# Altium project Serializer_Board.PrjPcb (part 1 of 2)
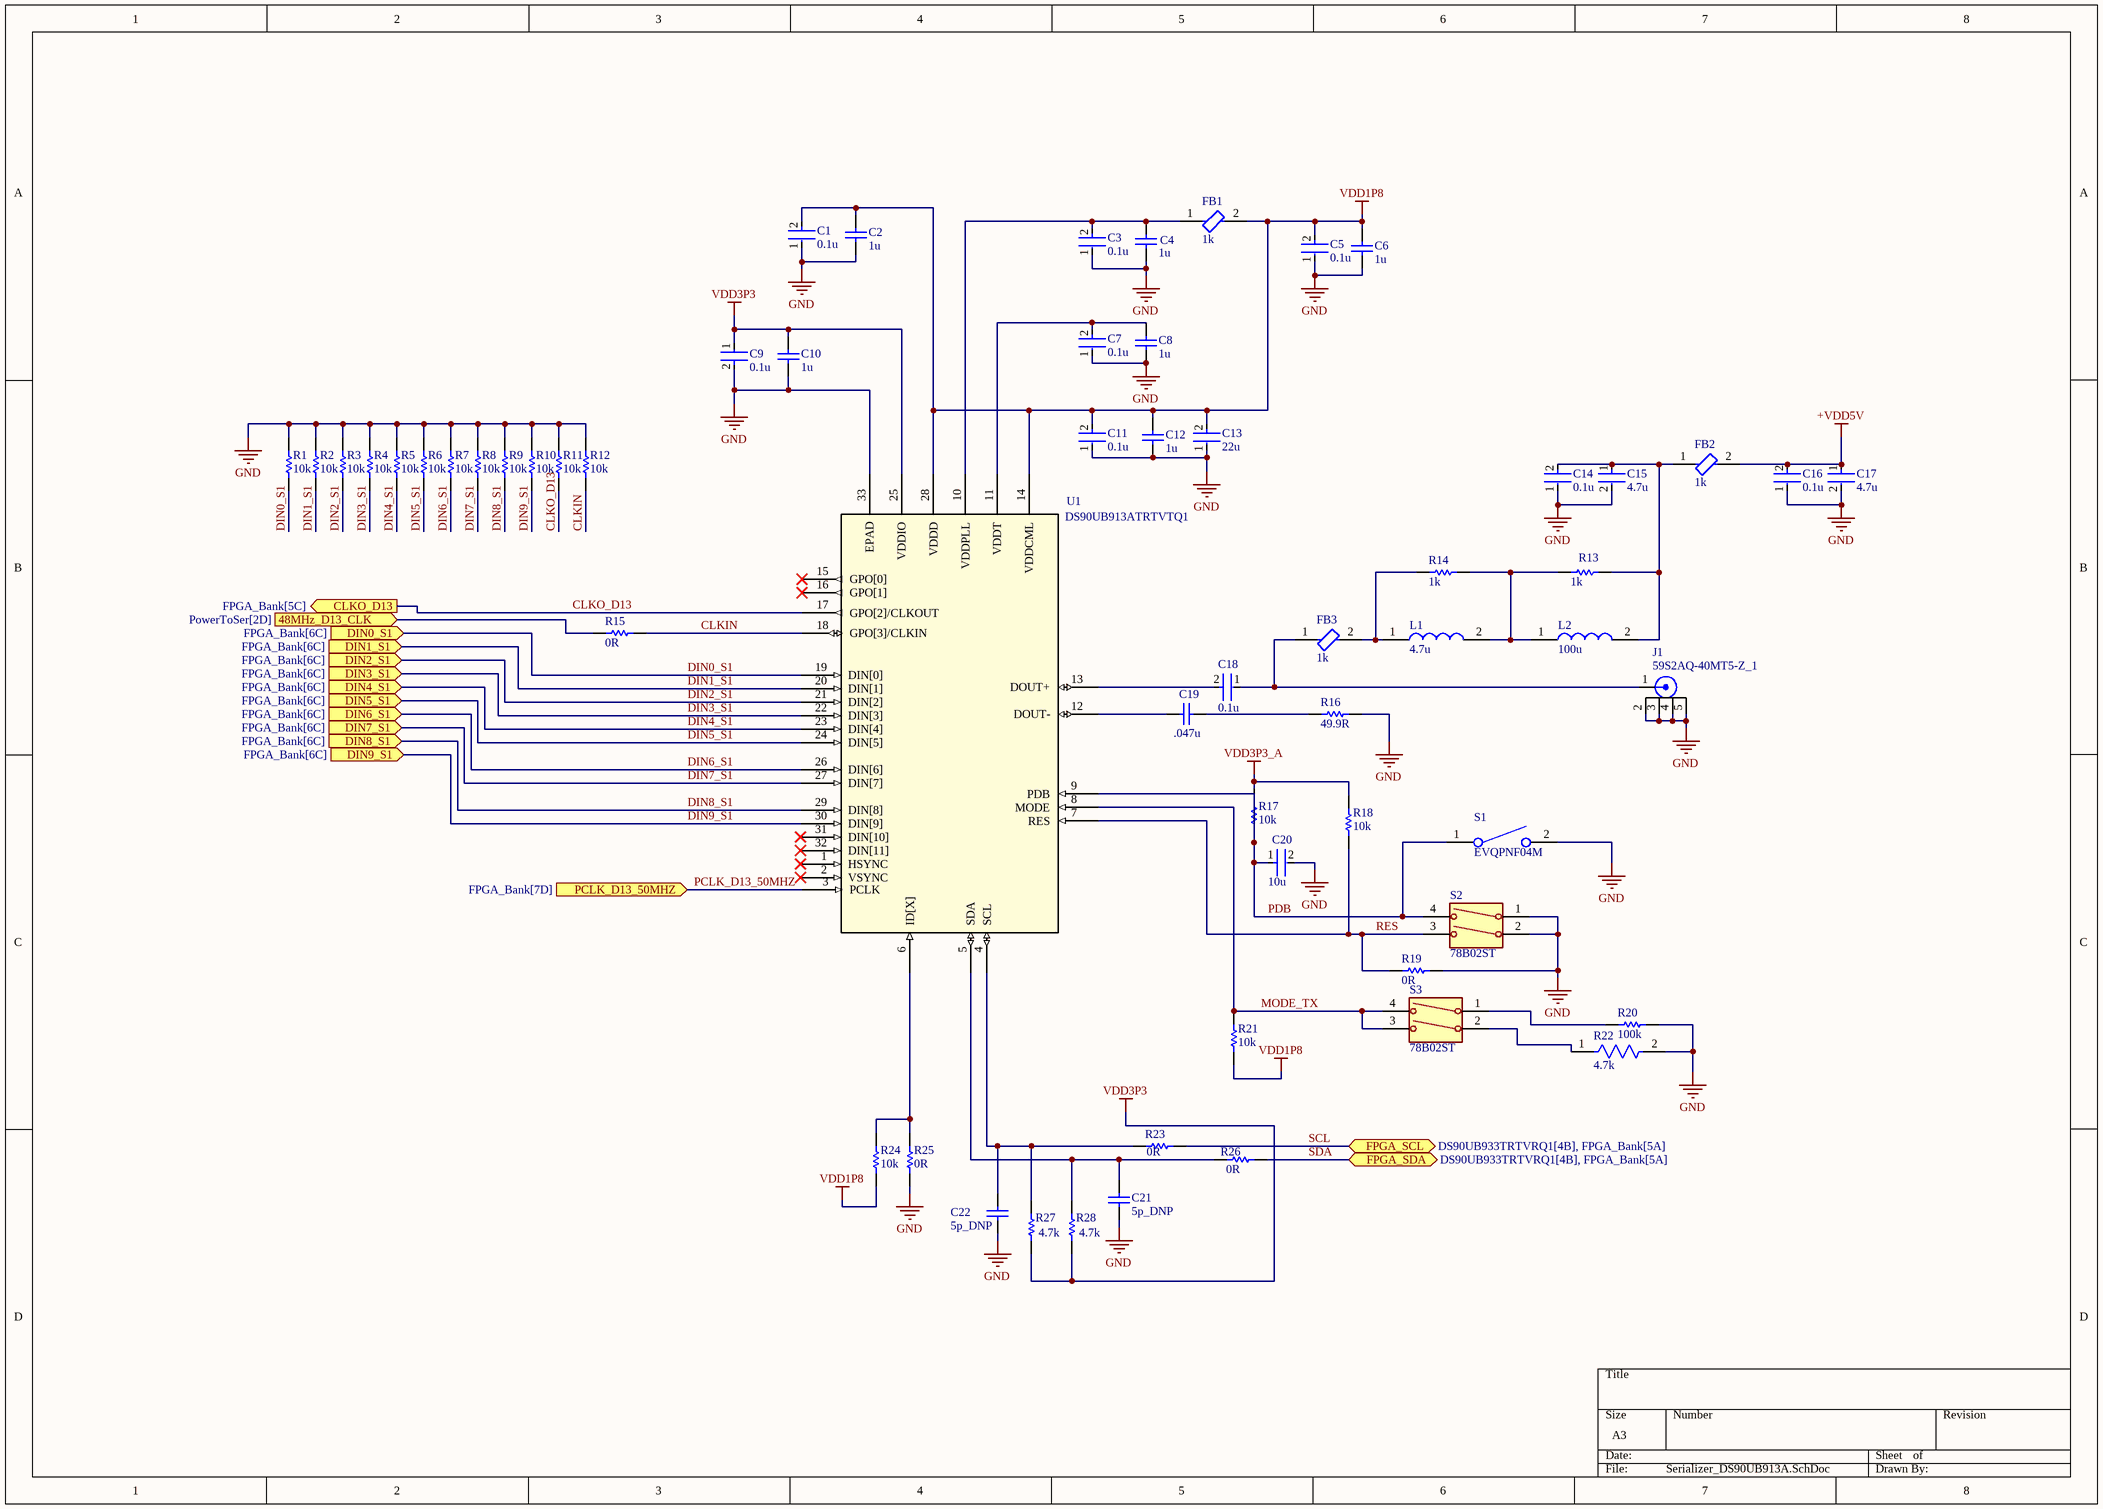
[diagram p0: Serializer_DS90UB913A.SchDoc]
5 sheets, 220 parts. Net scope: flat (ports and power ports of the same name join across sheets).
Sheets:
  Serializer_DS90UB913A.SchDoc
  BuckRegulatorOnSer.SchDoc
  PowerToSer.SchDoc
  FTDI_USB_To_UART.SchDoc
  FPGA_Bank.SchDoc

## Sheet Serializer_DS90UB913A.SchDoc
size A3; SheetNumber: 1; SheetTotal: 6

### Parts
C1  0.1u  [FP-GRM15-MFG]
C2  1u  [CAPC1608X90X35ML10T15]
C3  0.1u  [FP-GRM15-MFG]
C4  1u  [CAPC1608X90X35ML10T15]
C5  0.1u  [FP-GRM15-MFG]
C6  1u  [CAPC1608X90X35ML10T15]
C7  0.1u  [FP-GRM15-MFG]
C8  1u  [CAPC1608X90X35ML10T15]
C9  0.1u  [FP-GRM15-MFG]
C10  1u  [CAPC1608X90X35ML10T15]
C11  0.1u  [FP-GRM15-MFG]
C12  1u  [CAPC1608X90X35ML10T15]
C13  22u  [FP-GCM32E-0_3-IPC_B]
C14  0.1u  [FP-GRM15-MFG]
C15  4.7u  [FP-GRM21B-0_15-MFG]
C16  0.1u  [FP-GRM15-MFG]
C17  4.7u  [FP-GRM21B-0_15-MFG]
C18  0.1u  [FP-GRM15-MFG]
C19  .047u  [CAPC1608X90X35ML10T15]
C20  10u  [FP-GRM21B-0_1-IPC_C]
C21  5p_DNP  [CAPC1005X55X25LL05T10]
C22  5p_DNP  [CAPC1005X55X25LL05T10]
FB1  1k  [FP-BLM18-0_15-t0_8-MFG]
FB2  1k  [FP-BLM18-0_15-t0_8-MFG]
FB3  1k  [FP-BLM18-0_15-t0_8-MFG]
J1  59S2AQ-40MT5-Z_1  [ROSENBERGER_59S2AQ-40MT5-Z_1]
L1  4.7u  [1008PS]
L2  100u  [MSS7341T104MLB]
R1  10k  [RESC1005X40X25ML05T05]
R2  10k  [RESC1005X40X25ML05T05]
R3  10k  [RESC1005X40X25ML05T05]
R4  10k  [RESC1005X40X25ML05T05]
R5  10k  [RESC1005X40X25ML05T05]
R6  10k  [RESC1005X40X25ML05T05]
R7  10k  [RESC1005X40X25ML05T05]
R8  10k  [RESC1005X40X25ML05T05]
R9  10k  [RESC1005X40X25ML05T05]
R10  10k  [RESC1005X40X25ML05T05]
R11  10k  [RESC1005X40X25ML05T05]
R12  10k  [RESC1005X40X25ML05T05]
R13  1k  [RESC1608X55X30LL15T15]
R14  1k  [RESC1608X55X30LL15T15]
R15  0R  [RESC1005X40X25LL05T05]
R16  49.9R  [RESC1608X55X30ML15T15]
R17  10k  [RESC1005X40X25ML05T05]
R18  10k  [RESC1005X40X25ML05T05]
R19  0R  [RESC1005X40X25LL05T05]
R20  100k  [RESC2013X70X40ML20T20]
R21  10k  [RESC1005X40X25ML05T05]
R22  4.7k  [FP-ERJ6GE-MFG]
R23  0R  [RESC1005X40X25LL05T05]
R24  10k  [RESC1005X40X25ML05T05]
R25  0R  [RESC1005X40X25LL05T05]
R26  0R  [RESC1005X40X25LL05T05]
R27  4.7k  [RESC1005X40X25LL05T05]
R28  4.7k  [RESC1005X40X25LL05T05]
S1  EVQPNF04M  [EVQ5PN05K]
S2  78B02ST  [78B02ST]
S3  78B02ST  [78B02ST]
U1  DS90UB913ATRTVTQ1  [RTV32_3P1X3P1_TEX]

### Ports
48MHz_D13_CLK (in, see PowerToSer[2D]), CLKO_D13 (out, see FPGA_Bank[5C]), DIN0_S1 (in, see FPGA_Bank[6C]), DIN1_S1 (in, see FPGA_Bank[6C]), DIN2_S1 (in, see FPGA_Bank[6C]), DIN3_S1 (in, see FPGA_Bank[6C]), DIN4_S1 (in, see FPGA_Bank[6C]), DIN5_S1 (in, see FPGA_Bank[6C]), DIN6_S1 (in, see FPGA_Bank[6C]), DIN7_S1 (in, see FPGA_Bank[6C]), DIN8_S1 (in, see FPGA_Bank[6C]), DIN9_S1 (in, see FPGA_Bank[6C]), FPGA_SCL (bidir, see DS90UB933TRTVRQ1[4B], FPGA_Bank[5A]), FPGA_SDA (bidir, see DS90UB933TRTVRQ1[4B], FPGA_Bank[5A]), PCLK_D13_50MHZ (in, see FPGA_Bank[7D])

### Nets
+VDD5V: C16.2 C17.1 FB2.2
GND: C1.1 C2.1 C3.1 C4.1 C5.1 C6.1 C7.1 C8.1 C9.2 C10.1 C11.1 C12.1 C13.1 C14.1 C15.2 C16.1 C17.2 C20.2 C21.1 C22.1 J1.2 J1.3 J1.4 J1.5 R1.2 R2.2 R3.2 R4.2 R5.2 R6.2 R7.2 R8.2 R9.2 R10.2 R11.2 R12.2 R16.2 R19.1 R20.2 R22.2 R25.1 S1.2(NO) S2.1(COM_1) S2.2(NO_1) U1.33(EPAD)
VDD1P8: C1.2 C2.2 C5.2 C6.2 C11.2 C12.2 C13.2 FB1.2 R21.1 R24.1 U1.14(VDDCML) U1.28(VDDD)
VDD3P3: C9.1 C10.2 R27.1 R28.1 U1.25(VDDIO)
VDD3P3_A: R17.2 R18.2
CLKIN: R12.1 R15.1 U1.18(GPO[3]/CLKIN)  [project net CLKIN_1]
CLKO_D13: R11.1 U1.17(GPO[2]/CLKOUT) ; port CLKO_D13
DIN0_S1: R1.1 U1.19(DIN[0]) ; port DIN0_S1
DIN1_S1: R2.1 U1.20(DIN[1]) ; port DIN1_S1
DIN2_S1: R3.1 U1.21(DIN[2]) ; port DIN2_S1
DIN3_S1: R4.1 U1.22(DIN[3]) ; port DIN3_S1
DIN4_S1: R5.1 U1.23(DIN[4]) ; port DIN4_S1
DIN5_S1: R6.1 U1.24(DIN[5]) ; port DIN5_S1
DIN6_S1: R7.1 U1.26(DIN[6]) ; port DIN6_S1
DIN7_S1: R8.1 U1.27(DIN[7]) ; port DIN7_S1
DIN8_S1: R9.1 U1.29(DIN[8]) ; port DIN8_S1
DIN9_S1: R10.1 U1.30(DIN[9]) ; port DIN9_S1
MODE_TX: R21.2 S3.3(COM_2) S3.4(NO_2) U1.8(MODE)  [project net MODE_TX_1]
PCLK_D13_50MHZ: U1.3(PCLK) ; port PCLK_D13_50MHZ
PDB: C20.1 R17.1 S1.1(COM) S2.4(NO_2) U1.9(PDB)  [project net PDB_1]
RES: R18.1 R19.2 S2.3(COM_2) U1.7(RES)  [project net RES_1]
SCL: R23.1 ; port FPGA_SCL
SDA: R26.1 ; port FPGA_SDA
NetC3_2: C3.2 C4.2 FB1.1 U1.10(VDDPLL)
NetC7_2: C7.2 C8.2 U1.11(VDDT)
NetC14_2: C14.2 C15.1 FB2.1 L2.2 R13.2
NetC18_1: C18.1 FB3.1 J1.1
NetC18_2: C18.2 U1.13(DOUT+)
NetC19_1: C19.1 U1.12(DOUT-)
NetC19_2: C19.2 R16.1
NetC21_2: C21.2 R26.2 R28.2 U1.5(SDA)
NetC22_2: C22.2 R23.2 R27.2 U1.4(SCL)
NetFB3_2: FB3.2 L1.1 R14.1
NetL1_2: L1.2 L2.1 R13.1 R14.2
NetR15_2: R15.2 ; port 48MHz_D13_CLK
NetR20_1: R20.1 S3.1(COM_1)
NetR22_1: R22.1 S3.2(NO_1)
NetR24_2: R24.2 R25.2 U1.6(ID[X])

Not connected (* = marked no-connect by the designer): U1 1(HSYNC)* 2(VSYNC)* 15(GPO[0])* 16(GPO[1])* 31(DIN[10])* 32(DIN[11])*

### Library data of the parts
C1 C3 C5 C7 C9 C11 C14 C16 C18 = CMP-2100-03641-2: CAP CER 0.1UF 16V X7R 0402; Manufacturer Part Number: GRM155R71C104KA88D; Manufacturer: Murata; Standoff Height: 0mm; Tolerance: 10%; Voltage Rating: 16Vdc; Material: Ceramic; Capacitance: 0.10μF; Value: 0.10μF; RoHS: TRUE; Temperature Characteristic: X7R; Octopart: https://octopart.com/grm155r71c104ka88d-murata-196880; Digikey Description: CAP CER 0.1UF 16V X7R 0402; Device Class L3: Ceramic Capacitors; Height: 0.55mm; ComponentLink2Description: Datasheet; Temperature Range Low: -55°C; Ipc Land Pattern Name: CAPC10050X219; ComponentLink2URL: https://search.murata.co.jp/Ceramy/image/img/A01X/G101/ENG/GRM155R71H471KA01-01A.pdf; Device Class L1: Passive Components; Lead Free: yes; Category: Cap; Package: GRM15; Temperature: -55°C to +125°C; Device Class L2: Capacitors; Temperature Range High: +125°C; Mouser Description: 0402 0.1 uF 16V ±10 % Tolerance X7R SMT Multilayer Ceramic Capacitor
C2 C4 C6 C8 C10 C12 = CMP-2006-02460-1: Manufacturer: Murata; Part Number: GRM188R71E105KA12D
C13 = CMP-06035-049658-1: Ceramic Capacitor for Automotive 22uF ±10% 16VDC X7R 1210 Embossed T/R; Voltage Rating: 16V; Max Operating Temperature: 125°C; Case/Package: 1210; Packaging: Tape and Reel; Termination: SMD/SMT; Height: 2.5mm; Voltage Rating (DC): 16V; Length: 3.2mm; Width: 0.098inch; Voltage: 16V; Depth: 2.5mm; Package Quantity: 1; Mount: Surface Mount; Min Operating Temperature: -55°C; Case Code (Metric): 3225; Case Code (Imperial): 1210; Radiation Hardening: No; Thickness: 0.106inch; Ratings: AEC-Q200; Capacitance: 22uF; Tolerance: 10%; Dielectric: X7R; Lead Free: Lead Free
C15 C17 = CMP-2007-03401-2: CAP CER 4.7UF 16V X7R 0805; Material: Ceramic; Tolerance: 10%; Case Code (Metric): 2012; Voltage Rating: 16V; RoHS Compliant: Yes; Voltage Rating (DC): 16V; Case/Package: 0805; Number of Pins: 2; Thickness: 0.053inch; Voltage: 16V; Mount: Surface Mount; Packaging: Tape and Reel; Lead Free: Lead Free; Case Code (Imperial): 0805; Series: GRM; Width: 0.049inch; Package Quantity: 1; Construction: Flat; Min Operating Temperature: -55°C; Termination: SMD/SMT; Max Operating Temperature: 125°C; Length: 2mm; Dielectric: X7R; Depth: 1.25mm; REACH SVHC: No SVHC; Height: 1.25mm; Capacitance: 4.7uF
C19 = CMP-2006-02927-1: Manufacturer: Murata; Part Number: GRM188R71H473KA61D
C20 = CMP-2007-03453-2: Chip Multilayer Ceramic Capacitors for General Purpose, 0805, 10uF, X5R, 15%, 10%, 16V; Radiation Hardening: No; Thickness: 0.053inch; Voltage Rating (DC): 16V; Lead Free: Lead Free; Package Quantity: 1; Width: 1.25mm; Case Code (Imperial): 0805; Depth: 1.25mm; Packaging: Tape and Reel; Dielectric: X5R; Max Operating Temperature: 85°C; Tolerance: 10%; Voltage Rating: 16V; Voltage: 16V; Capacitance: 10uF; Height: 1.25mm; Case Code (Metric): 2012; Material: Ceramic; Mount: Surface Mount; Case/Package: 0805; REACH SVHC: No SVHC; Length: 2mm; Min Operating Temperature: -55°C; Termination: SMD/SMT
C21 C22 = CMP-2008-04391-1: Manufacturer: Murata; Part Number: GRM1555C1H5R0CA01D
FB1-FB3 = CMP-0686-00457-3: Chip Ferrite Bead, 0603, 1000Ω @ 100MHz, 0.5Ω, 25%, 450mABLM18AG102SN1D; Number of Circuits: 1; Max DC Current: 400mA; Shielding: Unshielded; DC Resistance (DCR): 500mR; Material: Steel; DC Resistance-Max: 700mR; Impedance: 1kR; Case Code (Imperial): 0603; Max Current Rating: 400mA; Frequency: 100MHz; Min Operating Temperature: -55°C; Case/Package: 0603; Depth: 0.8mm; Lead Free: Lead Free; Core Material: Ferrite; Current Rating: 400mA; Resistance: 500mR; Case Code (Metric): 1608; DC Current: 400mA; Package Quantity: 1; Packaging: Tape and Reel; Width: 0.8mm; Military Standard: Not; Height: 0.8mm; Series: BLM18A; Max Operating Temperature: 125°C; Tolerance: 25%; Termination: SMD/SMT; Test Frequency: 100MHz; Number of Lines: 1; Number of Pins: 2; REACH SVHC: No SVHC; Length: 1.6mm; Radiation Hardening: No
J1 = 59S2AQ-40MT5-Z_1: RF Connectors / Coaxial Connectors Plug PC-Board SMD Right AngleZWatrBlue; Package: None; Price: None; Value: *; MP: 59S2AQ-40MT5-Z_1; Availability: Unavailable
L1 = 1008PS-472KLB: Inductor; Manufacturer_Name: COILCRAFT; Datasheet Link: https://www.coilcraft.com/pdfs/1008ps.pdf; Manufacturer_Part_Number: 1008PS-472KLB; Mouser Part Number: 994-1008PS-472KLB; Mouser Price/Stock: https://www.mouser.co.uk/ProductDetail/Coilcraft/1008PS-472KLB?qs=zCSbvcPd3pZjtFGTYwqcAw%3D%3D
L2 = MSS7341T-104MLB: Inductor; Manufacturer_Name: COILCRAFT; Manufacturer_Part_Number: MSS7341T-104MLD; Datasheet Link: https://componentsearchengine.com/Datasheets/2/MSS7341T-104MLD.pdf; Height: 4.1mm; Mouser Part Number: 994-MSS7341T-104MLD; Mouser Price/Stock: https://www.mouser.co.uk/ProductDetail/Coilcraft/MSS7341T-104MLD?qs=zCSbvcPd3paCy6uSM7W%2FOg%3D%3D
R1-R12 R17 R18 R21 R24 = CMP-2002-00433-1: Part Number: ERJ-2GEJ103X; Manufacturer: Panasonic
R13 R14 = CMP-2000-00180-1: Part Number: ERJ-3EKF1001V; Manufacturer: Panasonic
R15 R19 R23 R25 R26 = CMP-2000-07451-1: Chip Resistor, 0 Ohm, 0.1 W, -55 to 155 degC, 0402 (1005 Metric), RoHS, Tape and Reel; Manufacturer: Panasonic; Voltage Rating (DC): 50V; Temperature Coefficient: 600ppm/��C; Max Power Dissipation: 100mW; Resistance: 0mOhm; Tolerance: 5%; Number of Terminations: 2; Mount: SurfaceMount; Height: 0.35mm; Packaging: TapeandReel; Contact Plating: Tin; Manufacturer URL: http://www.panasonic.com/; Composition: ThickFilm; Max Operating Temperature: 155degC; REACH SVHC: NoSVHC; Case/Package: 0402; Package Reference: 402; Depth: 0.5mm; Package Description: 2-Pin Surface Mount Device, Body 1 x 0.5 mm; Datasheet URL: https://industrial.panasonic.com/cdbs/www-data/pdf/RDA0000/AOA0000C301.pdf; RoHSCompliant: True; Case Code (Imperial): 0402; Military Standard: Not; Min Operating Temperature: -55degC; Power Rating: 100mW; Datasheet Version: 03/2015; Length: 1mm; Case Code (Metric): 1005; Termination: SMD/SMT; Mounting Technology: SurfaceMount; Voltage Rating: 50V; Width: 0.02inch; Package Quantity: 1; Lead Free: LeadFree; Radiation Hardening: No
R16 = CMP-2000-00538-1: Manufacturer: Panasonic; Part Number: ERJ-3EKF49R9V
R20 = CMP-2001-04377-1: Part Number: ERJ-6ENF1003V; Manufacturer: Panasonic
R22 = CMP-2001-00420-2: RES SMD 4.7K OHM 5% 1/8W 0805; Power Rating: 125mW; Voltage Rating (DC): 150V; Temperature Coefficient: 200ppm/°C; Resistance: 4.7kR; Lead Free: Lead Free; Length: 2mm; Resistance Tolerance: 5%; Tolerance: 5%; Mount: Surface Mount; Number of Terminations: 2; Technology: THICK FILM; Case Code (Metric): 2012; Resistor Type: Thick Film; Max Power Dissipation: 125mW; Series: ERJ; Radiation Hardening: No; Min Operating Temperature: -55°C; RoHS Compliant: Yes; Case/Package: 0805; Package Quantity: 5000; Size Code: 0805; Width: 0.049inch; Voltage Rating: 150V; Contact Plating: Tin; Military Standard: Not; Height: 0.6mm; Construction: Rectangular; Packaging: Tape and Reel; Max Operating Temperature: 155°C; Termination: SMD/SMT; REACH SVHC: No SVHC; Case Code (Imperial): 0805; Depth: 1.25mm
R27 R28 = CMP-2002-01154-4: Chip Resistor, 4.7 KOhm, +/- 1%, 0.1 W, -55 to 155 degC, 0402 (1005 Metric), RoHS, Tape and Reel; PartNumber: ERJ-2RKF4701X; Voltage Rating: 50 V; Case\/Package: 0402; Power Rating: 100 mW; Height: 0.35 mm; Mounting Technology: Surface Mount; REACH SVHC: Yes; Resistance: 4.7 KOhm; Max Operating Temperature: 155 degC; ComponentLink1Description: Manufacturer URL; ComponentLink2Description: Datasheet; Pins: 2; PackageReference: 0402; Tolerance: 1%; Case Code (Imperial): 0402; Length: 1 mm; PackageDescription: 2-Pin Surface Mount Device, Body 1 x 0.5 mm; RoHSCompliant: true; Package Quantity: 1; Radiation Hardening: No; DatasheetVersion: 04/2015; Width: 0.5 mm; Case Code (Metric): 1005; Mount: Surface Mount; ComponentLink1URL: http://www.panasonic.com/; Min Operating Temperature: -55 degC; Packaging: Cut Tape; ComponentLink2URL: http://industrial.panasonic.com/cdbs/www-data/pdf/RDA0000/AOA0000C86.pdf
S1 = EVQPNF04M: Switch; Manufacturer_Name: Panasonic; Datasheet Link: https://industrial.panasonic.com/cdbs/www-data/pdf/ATK0000/ATK0000C376.pdf; Manufacturer_Part_Number: EVQPNF04M
S2 S3 = 78B02ST: PCB Slide Switch Single Pole Single Throw (SPST) 150 mA Slide; Manufacturer_Name: Grayhill; Geometry.Height: 7.49mm; Mouser Part Number: 706-78B02ST; Mouser Price/Stock: https://www.mouser.co.uk/ProductDetail/Grayhill/78B02ST?qs=ls7QRyWmRk63wsT9ZvgLUg%3D%3D; Manufacturer_Part_Number: 78B02ST; Datasheet Link: https://datasheet.datasheetarchive.com/originals/distributors/SFDatasheet-7/sf-000148477.pdf
U1 = DS90UB913ATRTVTQ1: 25- to 100-MHz, 10-bit & 12-bit FPD-Link III serializer 32-WQFN -40 to 105; Manufacturer_Name: Texas Instruments; Copyright: Copyright (C) 2025 Ultra Librarian. All rights reserved.; Manufacturer_Part_Number: DS90UB913ATRTVTQ1; RefDes: RefDes; Type: Type

## Sheet BuckRegulatorOnSer.SchDoc
size 381 x 241 mm; SheetNumber: 2; SheetTotal: 6
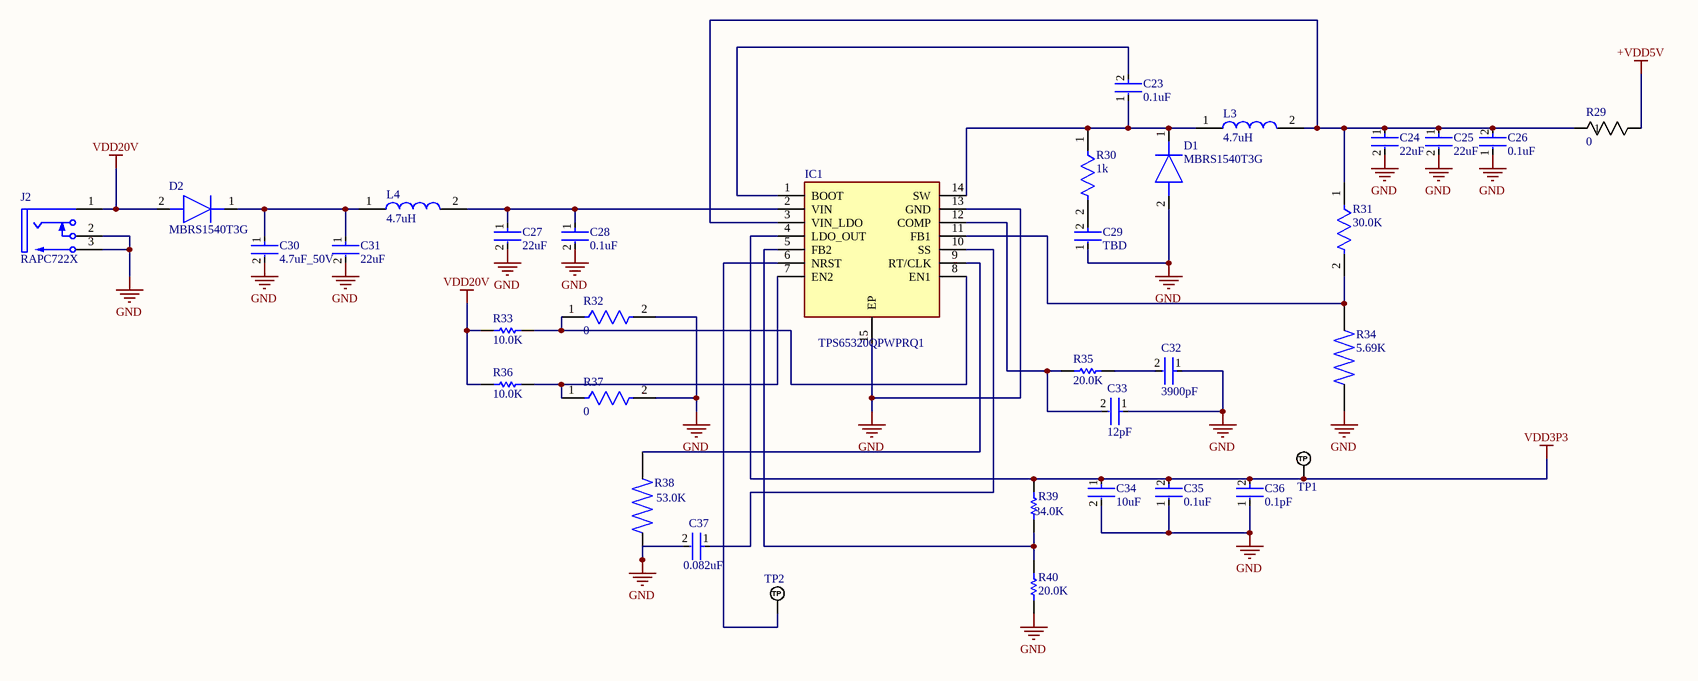
[diagram p1: BuckRegulatorOnSer.SchDoc]

### Parts
C23  0.1uF  [FP-GRM15-MFG]
C24  22uF  [FP-C3216-160-0_2-IPC_B]
C25  22uF  [FP-C3216-160-0_2-IPC_B]
C26  0.1uF  [FP-GRM15-MFG]
C27  22uF  [FP-C3216-160-0_2-IPC_B]
C28  0.1uF  [FP-GRM188-0_1-e0_2_0_5-IPC_B]
C29  TBD  [FP-GRM15-MFG]
C30  4.7uF_50V  [FP-C3216-160-0_2-IPC_B]
C31  22uF  [FP-C3216-160-0_2-IPC_B]
C32  3900pF  [FP-C0402-BB-MFG]
C33  12pF  [FP-C0402-BB-MFG]
C34  10uF  [FP-C2012-125-0_2-MFG]
C35  0.1uF  [FP-GRM15-MFG]
C36  0.1pF  [FP-GRM15-MFG]
C37  0.082uF  [FP-C0402-BB-MFG]
D1  MBRS1540T3G  [DIOM5436X256N]
D2  MBRS1540T3G  [DIOM5436X256N]
IC1  TPS65320QPWPRQ1  [SOP65P640X120-15N]
J2  RAPC722X  [SWITCH-RAPC712X-3_V]
L3  4.7uH  [XFL4020472MEB]
L4  4.7uH  [XFL4020472MEB]
R29  0  [RC2512N_VIS]
R30  1k  [FP-CRCW0603-e3-MFG]
R31  30.0K  [FP-ERJ3EK-IPC_A]
R32  0  [FP-ERJ-3GEY0R00V-MFG]
R33  10.0K  [RESC1609X55X30LL15T15]
R34  5.69K  [RESC1608X46N]
R35  20.0K  [RESC1608X55X30ML15T15]
R36  10.0K  [RESC1609X55X30LL15T15]
R37  0  [FP-ERJ-3GEY0R00V-MFG]
R38  53.0K  [RESC1608X46N]
R39  34.0K  [RESC1608X55X30ML15T15]
R40  20.0K  [RESC1608X55X30ML15T15]
TP1  TP_NOBOM  [PAD_RND_1MM]  (value not drawn)  (no BOM)
TP2  TP_NOBOM  [PAD_RND_1MM]  (value not drawn)  (no BOM)

### Nets
+VDD5V: R29.2
GND: C24.2 C25.2 C26.1 C27.2 C28.2 C29.1 C30.2 C31.2 C32.1 C33.1 C34.2 C35.1 C36.1 C37.2 D1.2(A) IC1.13(GND) IC1.15(EP) J2.2 J2.3 R32.2 R34.2 R37.2 R38.2 R40.2
VDD3P3: C34.1 C35.2 C36.2 IC1.4(LDO_OUT) R39.1 TP1.1(TP)
VDD20V: D2.2(A) J2.1 R33.1 R36.1
NetC23_1: C23.1 D1.1(K) IC1.14(SW) L3.1 R30.1
NetC23_2: C23.2 IC1.1(BOOT)
NetC24_1: C24.1 C25.1 C26.2 IC1.3(VIN_LDO) L3.2 R29.1 R31.1
NetC27_1: C27.1 C28.1 IC1.2(VIN) L4.2
NetC29_2: C29.2 R30.2
NetC30_1: C30.1 C31.1 D2.1(K) L4.1
NetC32_2: C32.2 R35.2
NetC33_2: C33.2 IC1.12(COMP) R35.1
NetC37_1: C37.1 IC1.10(SS)
NetIC1_5: IC1.5(FB2) R39.2 R40.1
NetIC1_6: IC1.6(NRST) TP2.1(TP)
NetIC1_7: IC1.7(EN2) R36.2 R37.1
NetIC1_8: IC1.8(EN1) R32.1 R33.2
NetIC1_9: IC1.9(RT/CLK) R38.1
NetIC1_11: IC1.11(FB1) R31.2 R34.1

### Library data of the parts
C23 C26 C29 C35 C36 = CMP-2100-03641-2: as C1 on sheet Serializer_DS90UB913A; RoHS: TRUE; Temperature Characteristic: X7R; Octopart: https://octopart.com/grm155r71c104ka88d-murata-196880; Digikey Description: CAP CER 0.1UF 16V X7R 0402; Device Class L3: Ceramic Capacitors; Height: 0.55mm; ComponentLink2Description: Datasheet; Temperature Range Low: -55°C; Ipc Land Pattern Name: CAPC10050X219; ComponentLink2URL: https://search.murata.co.jp/Ceramy/image/img/A01X/G101/ENG/GRM155R71H471KA01-01A.pdf; Device Class L1: Passive Components; Lead Free: yes; Category: Cap; Package: GRM15; Temperature: -55°C to +125°C; Device Class L2: Capacitors; Temperature Range High: +125°C; Mouser Description: 0402 0.1 uF 16V ±10 % Tolerance X7R SMT Multilayer Ceramic Capacitor
C24 C25 C27 C31 = CMP-08246-004697-1: Multilayer Ceramic Capacitors 22uF ±20% 25V X5R SMD 1206; RoHS Compliant: Yes; Thickness: 0.071inch; Mount: Surface Mount; Termination: SMD/SMT; Height: 1.6mm; Resistor Type: Ceramic; REACH SVHC: No SVHC; Packaging: Tape and Reel; Construction: Flat; Depth: 1.6mm; Lead Free: Lead Free; Tolerance: 20%; Width: 0.063inch; Capacitance: 22uF; Weight: 0.000571oz; Case Code (Imperial): 1206; Case/Package: 1206; Min Operating Temperature: -55°C; Package Quantity: 1; Voltage Rating (DC): 25V; Length: 3.2mm; Voltage Rating: 25V; Case Code (Metric): 3216; Dielectric: X5R; Series: C; Dielectric Material: Ceramic; Max Operating Temperature: 85°C
C28 = CMP-1035-02595-8: Chip Multilayer Ceramic Capacitors for General Purpose, 0603, 0.10uF, X7R, 15%, 10%, 100V; Capacitance: 100nF; Voltage Rating (DC): 100V; Material: Ceramic; Packaging: Tape and Reel; Dielectric: X7R; Case Code (Imperial): 0603; Package Quantity: 1; Height: 0.8mm; Weight: 0.000222oz; Min Operating Temperature: -55°C; Depth: 0.8mm; Mount: Surface Mount; Thickness: 0.035inch; Voltage: 100V; REACH SVHC: No SVHC; Case/Package: 0603; Voltage Rating: 100V; Width: 0.8mm; Tolerance: 10%; Lead Free: Lead Free; Case Code (Metric): 1608; Radiation Hardening: No; Max Operating Temperature: 125°C; Termination: SMD/SMT; Length: 1.6mm
C30 = CMP-08246-002892-1: Multilayer Ceramic Capacitors 4.7uF ±20% 50V X7R SMD 1206; Depth: 1.6mm; Radiation Hardening: No; Length: 3.2mm; Dielectric: X7R; RoHS Compliant: Yes; Packaging: Tape and Reel; Voltage Rating: 50V; Voltage Rating (DC): 50V; Min Operating Temperature: -55°C; Resistor Type: Ceramic; Lead Free: Lead Free; Case/Package: 1206; Dielectric Material: Ceramic; Max Operating Temperature: 125°C; Series: C; Width: 0.063inch; Height: 1.6mm; Weight: 0.000571oz; Thickness: 1.6mm; Capacitance: 4.7uF; Case Code (Imperial): 1206; Tolerance: 20%; Construction: Flat; Case Code (Metric): 3216; Termination: SMD/SMT; Mount: Surface Mount; Package Quantity: 1
C32 = CMP-1034-01791-3: CAP CER 3900PF 16V X7R 0402; Manufacturer Part Number: C0402C392K4RACTU; Manufacturer: Kemet; Value: 3,900 pF; Temperature Coefficient: 15%; Tolerance: 0.1; Material: Ceramic; Temperature Range High: +125°C; Automotive: No; Octopart: https://octopart.com/c0402c392k4ractu-kemet-12577363; RoHS: TRUE; Category: Cap; Temperature Range Low: -55°C; Device Class L1: Passive Components; Digikey Description: CAP CER 3900PF 16V X7R 0402; ComponentLink2Description: Datasheet; Voltage Rating: 16 V; Device Class L2: Capacitors; ComponentLink2URL: https://content.kemet.com/datasheets/KEM_C1002_X7R_SMD.pdf; Package: C0402-BB; Lead Free: Yes; Ipc Land Pattern Name: CAPC10050X50; Mouser Description: Multilayer Ceramic Capacitors MLCC - SMD/SMT 16volts 3900pF X7R 10%; Temperature Characteristic: X7R; Height: 0.55mm; Temperature: -55°C to +125°C; Device Class L3: Ceramic Capacitors; Capacitance: 3,900 pF
C33 = CMP-2008-03330-2: CAP CER 12PF 25V C0G/NP0 0402; Manufacturer Part Number: C0402C120J3GACAUTO; Manufacturer: Kemet; Material: Ceramic; Temperature Characteristic: C0G; Temperature Coefficient: 15%; Tolerance: 0.05; Temperature Range High: +125°C; ComponentLink2URL: https://content.kemet.com/datasheets/KEM_C1002_X7R_SMD.pdf; Lead Free: Yes; Device Class L2: Capacitors; Voltage Rating: 25 V; Device Class L1: Passive Components; Temperature Range Low: -55°C; Value: 12 pF; Automotive: No; Category: Cap; Height: 0.55mm; Octopart: https://octopart.com/c0402c120j3gacauto-kemet-21768529; Digikey Description: CAP CER 12PF 25V C0G/NP0 0402; Temperature: -55°C to +125°C; Device Class L3: Ceramic Capacitors; Package: C0402-BB; Capacitance: 12 pF; ComponentLink2Description: Datasheet; Ipc Land Pattern Name: CAPC10050X50; RoHS: TRUE
C34 = CMP-2000-05452-2: Multilayer Ceramic Capacitors 10μF ±10% 10V X7R SMD 0805; Series: C; Case/Package: 0805; REACH SVHC: No SVHC; Tolerance: 10%; Resistor Type: Ceramic; Termination: SMD/SMT; Weight: 0.000194oz; Depth: 1.25mm; Capacitance: 10uF; Construction: Flat; RoHS Compliant: Yes; Contact Plating: Tin; Packaging: Tape and Reel; Mount: Surface Mount; Thickness: 0.057inch; Radiation Hardening: No; Dielectric: X7R; Min Operating Temperature: -55°C; Voltage Rating (DC): 10V; Voltage: 10V; Width: 0.049inch; Package Quantity: 1; Number of Pins: 2; Height: 1.25mm; Max Operating Temperature: 125°C; Dielectric Material: Ceramic; Case Code (Imperial): 0805; Lead Free: Lead Free; Voltage Rating: 10V; Case Code (Metric): 2012; Length: 2mm
C37 = CMP-1034-02057-3: Multilayer Ceramic Capacitor, C Series, 0.082 - F, - 10%, X7r, 16 V, 0402 [1005 Metric] Rohs Compliant: Yes; Manufacturer: Kemet; Manufacturer Part Number: C0402C823K4RACTU; Capacitance: 82,000 pF; Voltage Rating: 16 V; Temperature Coefficient: 15%; Value: 82,000 pF; Tolerance: 0.1; Device Class L2: Capacitors; ComponentLink2Description: Datasheet; Category: Cap; Temperature Range High: +125°C; Height: 0.55mm; Lead Free: Yes; Octopart: https://octopart.com/c0402c823k4ractu-kemet-134782; Device Class L3: Ceramic Capacitors; Ipc Land Pattern Name: CAPC10050X50; Package: C0402-BB; Temperature Range Low: -55°C; Temperature: -55°C to +125°C; Mouser Description: Multilayer Ceramic Capacitors MLCC - SMD/SMT 16volts 82000pF X7R 10%; Material: Ceramic; ComponentLink2URL: https://content.kemet.com/datasheets/KEM_C1002_X7R_SMD.pdf; Device Class L1: Passive Components; RoHS: TRUE; Automotive: No; Temperature Characteristic: X7R; Digikey Description: Multilayer Ceramic Capacitor, C Series, 0.082 - F, - 10%, X7r, 16 V, 0402 [1005 Metric] Rohs Compliant: Yes
D1 D2 = MBRS1540T3G: Diode; Manufacturer_Name: onsemi; Datasheet Link: https://www.onsemi.com/pub/Collateral/MBRS1540T3-D.PDF; Height: 2.56mm; Manufacturer_Part_Number: MBRS1540T3G; Mouser Part Number: 863-MBRS1540T3G; Mouser Price/Stock: https://www.mouser.co.uk/ProductDetail/onsemi/MBRS1540T3G?qs=3JMERSakeboNHqMh%252BSYqYg%3D%3D; Arrow Part Number: MBRS1540T3G; Arrow Price/Stock: https://www.arrow.com/en/products/mbrs1540t3g/on-semiconductor?utm_currency=USD&region=europe
IC1 = TPS65320QPWPRQ1: Integrated Circuit; Manufacturer_Name: Texas Instruments; Datasheet Link: https://www.ti.com/general/docs/suppproductinfo.tsp?distId=10&gotoUrl=https%3A%2F%2Fwww.ti.com%2Flit%2Fgpn%2Ftps65320-q1; Height: 1.2mm; Manufacturer_Part_Number: TPS65320QPWPRQ1; Mouser Part Number: 595-TPS65320QPWPRQ1; Mouser Price/Stock: https://www.mouser.co.uk/ProductDetail/Texas-Instruments/TPS65320QPWPRQ1?qs=FBI%252BX3tnPf3UK2GiH7QeCQ%3D%3D; Arrow Part Number: TPS65320QPWPRQ1; Arrow Price/Stock: https://www.arrow.com/en/products/tps65320qpwprq1/texas-instruments
J2 = CMP-2000-05384-1: Power Jack, 5 A, 3-Pin THD, RoHS, Bulk; Manufacturer: Switchcraft; Current Rating: 5A; Plug/Mating Plug Diameter: 2.1mmID,5.5mmOD; Gender: Male; Mating Products: S765-ND / -CONNPLUGMINIPWR2CONDWHT/RED / S760K-ND / -CONNPOWERPLUGMINI.08"BLACK / SC1052-ND / -CONNPOWERPLUGMINIBLACK; Number of Positions/Contacts: 2Conductors,2Contacts; Internal Switch(s): SingleSwitch,NormallyClosed; Shielding: Unshielded; Catalog Drawings: RAPC7(1,2)2XSide / RAPC7(1,2)2XTop; Dynamic Catalog: SwitchcraftInc; Other Names: Q2287470A / RAPC722X-ND / SC1313; Standard Package: 2,500; Termination: SolderEyelet(s); Family: Barrel-PowerConnectors; Housing Color: Black; Housing Material: Thermoplastic; RoHS Information: SwitchcraftRoHSInfo; Color: Black; Contact Material - Plating: Nickel; Mounting Type: ThroughHole,RightAngle; Manufacturer URL: http://www.switchcraft.com/; Contact Material: Brass; Datasheet Version: Rev. A, 08/2005; Connector Type: Jack; Category: Connectors,Interconnects; Datasheet URL: http://www.mouser.com/ds/2/393/rapc722x_cd-371352.pdf
L3 L4 = XFL4020-472MEB: Inductor; Manufacturer_Name: COILCRAFT; Datasheet Link: https://componentsearchengine.com/Datasheets/1/XFL4020-472MEB.pdf; Height: 2.1mm; Manufacturer_Part_Number: XFL4020-472MEB; Mouser Part Number: 994-XFL4020-472MEB; Mouser Price/Stock: https://www.mouser.co.uk/ProductDetail/Coilcraft/XFL4020-472MEB?qs=VJjuEbE9QBPFBMgGchYEoQ%3D%3D
R29 = CRCW25120000Z0EGHP: CRCW2512-HP 0R0 E67 E3; Manufacturer_Name: Vishay; Copyright: Copyright (C) 2025 Ultra Librarian. All rights reserved.; Manufacturer_Part_Number: CRCW25120000Z0EGHP; Datasheet: https://www.vishay.com/doc?20043
R30 = CMP-1666-00003-5: RES Thick Film, 1kΩ, 1%, 0.1W, 100ppm/°C, 0603; Max Power Dissipation: 100mW; Voltage Rating: 75V; Resistance: 1kR; Max Operating Temperature: 155°C; Number of Pins: 2; Case Code (Imperial): 0603; Width: 0.033inch; Power Rating: 100mW; Number of Terminations: 2; Package Quantity: 10; Weight: 7.1E-05oz; Tolerance: 1%; Temperature Coefficient: 100ppm/°C; Military Standard: Not; Mount: Surface Mount; Voltage Rating (DC): 75V; Depth: 0.85mm; Composition: Thick Film; Radiation Hardening: No; Termination: SMD/SMT; Length: 1.55mm; Case Code (Metric): 1608; Contact Plating: Tin; Min Operating Temperature: -55°C; Packaging: Tape and Reel; Height: 0.45mm; Lead Free: Lead Free; Case/Package: 0603; Features: Automotive AEC-Q200
R31 = CMP-2000-00413-2: RES SMD 30K OHM 1% 1/10W 0603; Voltage Rating: 75V; Temperature Coefficient: 100ppm/°C; Max Power Dissipation: 100mW; Resistance: 30kR; Case Code (Imperial): 0603; Termination: SMD/SMT; Number of Terminations: 2; Series: ERJ; Features: Automotive AEC-Q200; Width: 0.031inch; Packaging: Tape and Reel; REACH SVHC: No SVHC; Lead Free: Lead Free; RoHS Compliant: Yes; Contact Plating: Tin; Case/Package: 0603; Tolerance: 1%; Mount: Surface Mount; Min Operating Temperature: -55°C; Resistor Type: Thick Film; Radiation Hardening: No; Resistance Tolerance: 1%; Construction: Rectangular; Power Rating: 100mW; Case Code (Metric): 1608; Size Code: 0603; Voltage Rating (DC): 75V; Military Standard: Not; Package Quantity: 1; Depth: 0.8mm; Length: 1.6mm; Height: 0.022inch; Max Operating Temperature: 155°C
R32 R37 = CMP-2000-00700-2: RES SMD 0 OHM JUMPER 1/10W 0603; Manufacturer Part Number: ERJ-3GEY0R00V; Manufacturer: Panasonic; Tolerance: 5%; Automotive Grade: Grade 0; Voltage Rating: 75V; Value: 0Ω; Temperature Coefficient: -100/+600ppm/°C; Power Rating: 0.1W; Mouser Description: Resistor, Chip Thick Film, 0 Ohm, 0.1w, Resistor, Chip Thick Film, 0 Ohm, 0.1w, 5%; Ipc Land Pattern Name: RESC16080X45; Category: Res; Package: 0603; Temperature: -55°C to +155°C; Temperature Range Low: -55°C; Series: ERJ; Resistance: 0Ω; RoHS: TRUE; Composition: Thick Film; Octopart: https://octopart.com/erj-3gey0r00v-panasonic-55389238; Device Class L1: Passive Components; Footprint Url: https://industrial.panasonic.com/cdbs/www-data/pdf/RDA0000/DMA0000COL17.pdf; ComponentLink2Description: Datasheet; Device Class L2: Resistors; Temperature Range High: +155°C; Digikey Description: RES SMD 0 OHM JUMPER 1/10W 0603; Lead Free: Yes; Device Class L3: Chip SMD Resistors; Height: 0.55mm; ComponentLink2URL: https://industrial.panasonic.com/cdbs/www-data/pdf/RDA0000/AOA0000C301.pdf; Automotive: Yes
R33 R36 = CMP-1012-00623-3: Chip Resistor, 10 KOhm, +/- 1%, 0.1 W, -55 to 155 degC, 0603 (1608 Metric), RoHS, Tape and Reel; Manufacturer: Panasonic; Voltage Rating: 75V; Case\/Package: 0603; Power Rating: 100mW; Resistance: 10KOhm; Temperature Coefficient: 100ppm\/degreesC; Number of Pins: 2; Package Reference: 603; Depth: 0.8mm; Mount: SurfaceMount; Package Description: 2-Pin Surface Mount Device, Body 1.6 x 0.85 mm; Datasheet Version: 02/2017; Length: 1.6mm; Lead Free: LeadFree; Height: 0.45mm; Number of Terminations: 2; Max Power Dissipation: 100mW; Min Operating Temperature: -55degC; Datasheet URL: https://industrial.panasonic.com/cdbs/www-data/pdf/RDA0000/AOA0000C304.pdf; Termination: SMD/SMT; Case Code (Metric): 1608; Case Code (Imperial): 0603; Tolerance: 1%; Max Operating Temperature: 155degC; RoHSCompliant: true; Voltage Rating (DC): 75V; Radiation Hardening: No; Packaging: TapeandReel; Composition: ThickFilm; Mounting Technology: SurfaceMount; Manufacturer URL: http://www.panasonic.com/; Width: 0.031inch; REACH SVHC: NoSVHC; Contact Plating: Tin; Military Standard: Not; Package Quantity: 1
R34 = PAT0603E5691BST1: Package: None; Price: None; Value: *; MP: PAT0603E5691BST1; Availability: Unavailable
R35 R40 = CMP-2000-00318-1: Part Number: ERJ-3EKF2002V; Manufacturer: Panasonic
R38 = PAT0603E5302BST1: Package: None; Price: None; Value: *; MP: PAT0603E5302BST1; Availability: Unavailable
R39 = CMP-2000-00447-1: Part Number: ERJ-3EKF3402V; Manufacturer: Panasonic
TP1 TP2 = TEST_POINT_RND_1MM: Test Point Round 1mm (NO BOM)

## Sheet PowerToSer.SchDoc
size A4; SheetNumber: 3; SheetTotal: 6
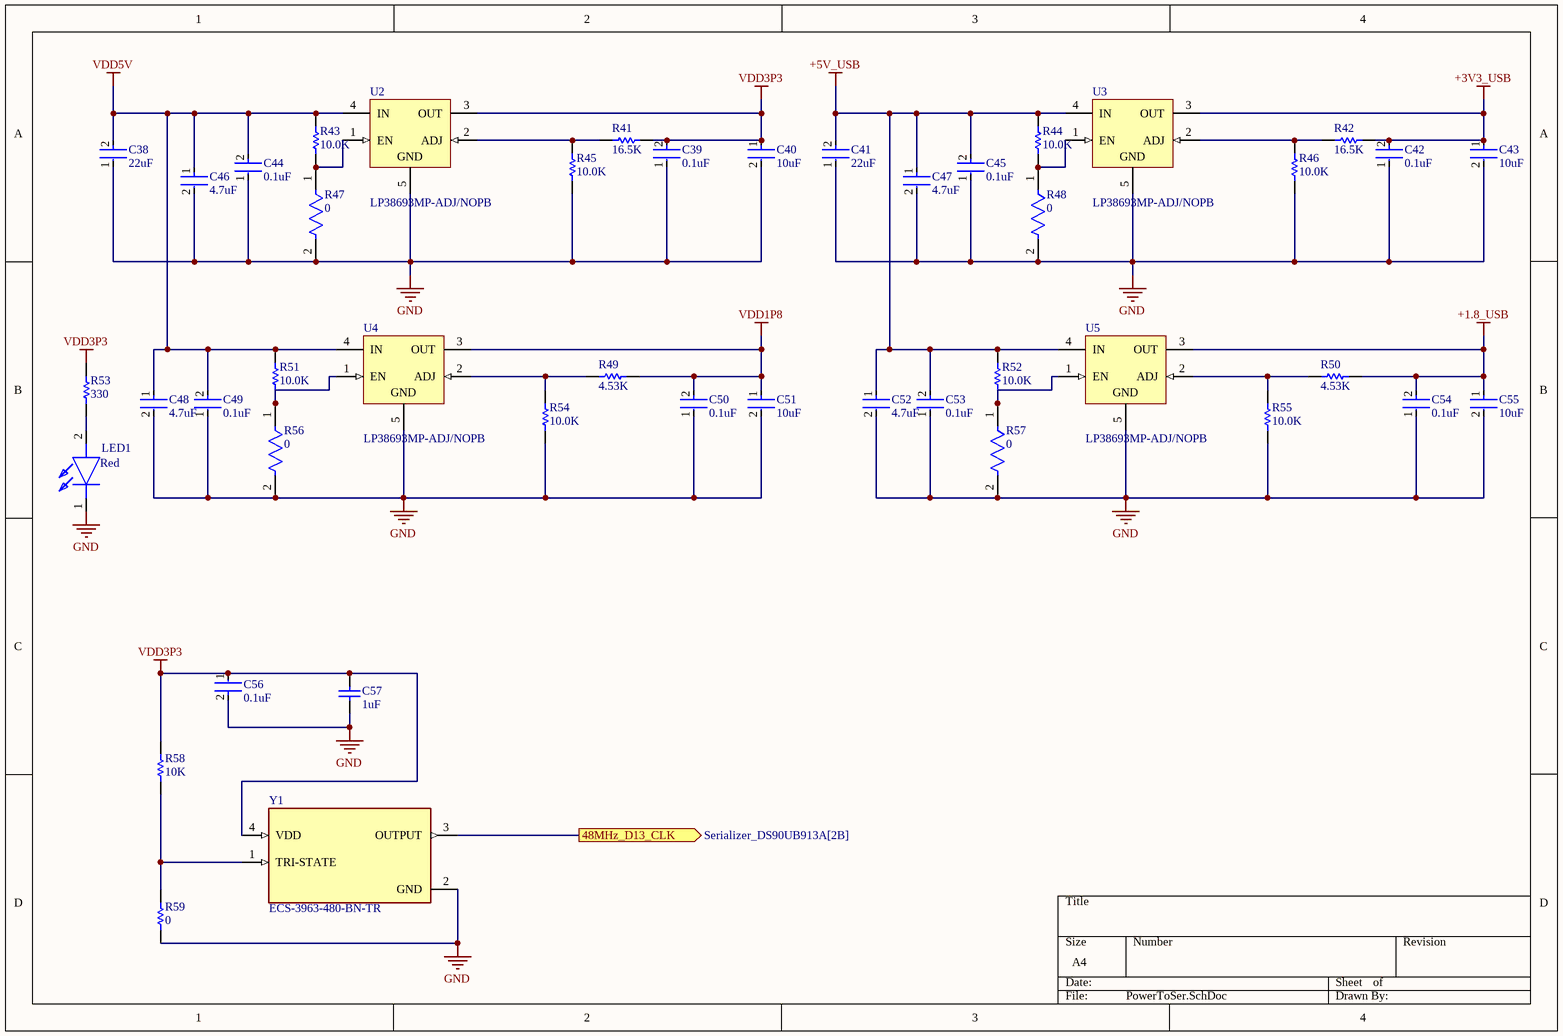
[diagram p2: PowerToSer.SchDoc]

### Parts
C38  22uF  [FP-GCM32E-0_3-IPC_B]
C39  0.1uF  [FP-GRM15-MFG]
C40  10uF  [FP-GRM21B-0_1-IPC_C]
C41  22uF  [FP-GCM32E-0_3-IPC_B]
C42  0.1uF  [FP-GRM15-MFG]
C43  10uF  [FP-GRM21B-0_1-IPC_C]
C44  0.1uF  [FP-GRM15-MFG]
C45  0.1uF  [FP-GRM15-MFG]
C46  4.7uF  [FP-GRM21B-0_15-MFG]
C47  4.7uF  [FP-GRM21B-0_15-MFG]
C48  4.7uF  [FP-GRM21B-0_15-MFG]
C49  0.1uF  [FP-GRM15-MFG]
C50  0.1uF  [FP-GRM15-MFG]
C51  10uF  [FP-GRM21B-0_1-IPC_C]
C52  4.7uF  [FP-GRM21B-0_15-MFG]
C53  0.1uF  [FP-GRM15-MFG]
C54  0.1uF  [FP-GRM15-MFG]
C55  10uF  [FP-GRM21B-0_1-IPC_C]
C56  0.1uF  [FP-GRM15-MFG]
C57  1uF  [CAPC1608X90X35ML10T15]
LED1  Red  [LEDC1608X55N]
R41  16.5K  [RESC1608X55X30LL15T15]
R42  16.5K  [RESC1608X55X30LL15T15]
R43  10.0K  [RESC1609X55X30LL15T15]
R44  10.0K  [RESC1609X55X30LL15T15]
R45  10.0K  [RESC1609X55X30LL15T15]
R46  10.0K  [RESC1609X55X30LL15T15]
R47  0  [FP-ERJ-3GEY0R00V-MFG]
R48  0  [FP-ERJ-3GEY0R00V-MFG]
R49  4.53K  [RESC1608X55X30ML15T15]
R50  4.53K  [RESC1608X55X30ML15T15]
R51  10.0K  [RESC1609X55X30LL15T15]
R52  10.0K  [RESC1609X55X30LL15T15]
R53  330  [RESC1005X40X25ML05T05]
R54  10.0K  [RESC1609X55X30LL15T15]
R55  10.0K  [RESC1609X55X30LL15T15]
R56  0  [FP-ERJ-3GEY0R00V-MFG]
R57  0  [FP-ERJ-3GEY0R00V-MFG]
R58  10K  [RESC1005X40X25ML05T05]
R59  0  [RESC1005X40X25LL05T05]
U2  LP38693MP-ADJ/NOPB  [NDC0005A_N]
U3  LP38693MP-ADJ/NOPB  [NDC0005A_N]
U4  LP38693MP-ADJ/NOPB  [NDC0005A_N]
U5  LP38693MP-ADJ/NOPB  [NDC0005A_N]
Y1  ECS-3963-480-BN-TR  [OSC_ECS-3963-480-BN-TR]

### Ports
48MHz_D13_CLK (out, see Serializer_DS90UB913A[2B])

### Nets
+1.8_USB: C54.2 C55.1 R50.2 U5.3(OUT)
+3V3_USB: C42.2 C43.1 R42.2 U3.3(OUT)
+5V_USB: C41.2 C45.2 C47.1 C52.1 C53.2 R44.1 R52.1 U3.4(IN) U5.4(IN)
GND: C38.1 C39.1 C40.2 C41.1 C42.1 C43.2 C44.1 C45.1 C46.2 C47.2 C48.2 C49.1 C50.1 C51.2 C52.2 C53.1 C54.1 C55.2 C56.2 C57.2 LED1.1(K) R45.2 R46.2 R47.2 R48.2 R54.2 R55.2 R56.2 R57.2 R59.2 U2.5(GND) U3.5(GND) U4.5(GND) U5.5(GND) Y1.2(GND)
VDD1P8: C50.2 C51.1 R49.2 U4.3(OUT)
VDD3P3: C39.2 C40.1 C56.1 C57.1 R41.2 R53.1 R58.1 U2.3(OUT) Y1.4(VDD)
VDD5V: C38.2 C44.2 C46.1 C48.1 C49.2 R43.1 R51.1 U2.4(IN) U4.4(IN)
NetLED1_2: LED1.2(A) R53.2
NetR15_2: Y1.3(OUTPUT) ; port 48MHz_D13_CLK
NetR41_1: R41.1 R45.1 U2.2(ADJ)
NetR42_1: R42.1 R46.1 U3.2(ADJ)
NetR43_2: R43.2 R47.1 U2.1(EN)
NetR44_2: R44.2 R48.1 U3.1(EN)
NetR49_1: R49.1 R54.1 U4.2(ADJ)
NetR50_1: R50.1 R55.1 U5.2(ADJ)
NetR51_2: R51.2 R56.1 U4.1(EN)
NetR52_2: R52.2 R57.1 U5.1(EN)
NetR58_2: R58.2 R59.1 Y1.1(TRI-STATE)

### Library data of the parts
C38 C41 = CMP-06035-049658-1: as C13 on sheet Serializer_DS90UB913A; Max Operating Temperature: 125°C; Case/Package: 1210; Packaging: Tape and Reel; Termination: SMD/SMT; Height: 2.5mm; Voltage Rating (DC): 16V; Length: 3.2mm; Width: 0.098inch; Voltage: 16V; Depth: 2.5mm; Package Quantity: 1; Mount: Surface Mount; Min Operating Temperature: -55°C; Case Code (Metric): 3225; Case Code (Imperial): 1210; Radiation Hardening: No; Thickness: 0.106inch; Ratings: AEC-Q200; Capacitance: 22uF; Tolerance: 10%; Dielectric: X7R; Lead Free: Lead Free
C39 C42 C44 C45 C49 C50 C53 C54 C56 = CMP-2100-03641-2: as C1 on sheet Serializer_DS90UB913A; RoHS: TRUE; Temperature Characteristic: X7R; Octopart: https://octopart.com/grm155r71c104ka88d-murata-196880; Digikey Description: CAP CER 0.1UF 16V X7R 0402; Device Class L3: Ceramic Capacitors; Height: 0.55mm; ComponentLink2Description: Datasheet; Temperature Range Low: -55°C; Ipc Land Pattern Name: CAPC10050X219; ComponentLink2URL: https://search.murata.co.jp/Ceramy/image/img/A01X/G101/ENG/GRM155R71H471KA01-01A.pdf; Device Class L1: Passive Components; Lead Free: yes; Category: Cap; Package: GRM15; Temperature: -55°C to +125°C; Device Class L2: Capacitors; Temperature Range High: +125°C; Mouser Description: 0402 0.1 uF 16V ±10 % Tolerance X7R SMT Multilayer Ceramic Capacitor
C40 C43 C51 C55 = CMP-2007-03453-2: as C20 on sheet Serializer_DS90UB913A; Radiation Hardening: No; Thickness: 0.053inch; Voltage Rating (DC): 16V; Lead Free: Lead Free; Package Quantity: 1; Width: 1.25mm; Case Code (Imperial): 0805; Depth: 1.25mm; Packaging: Tape and Reel; Dielectric: X5R; Max Operating Temperature: 85°C; Tolerance: 10%; Voltage Rating: 16V; Voltage: 16V; Capacitance: 10uF; Height: 1.25mm; Case Code (Metric): 2012; Material: Ceramic; Mount: Surface Mount; Case/Package: 0805; REACH SVHC: No SVHC; Length: 2mm; Min Operating Temperature: -55°C; Termination: SMD/SMT
C46-C48 C52 = CMP-2007-03401-2: as C15 on sheet Serializer_DS90UB913A; Case Code (Metric): 2012; Voltage Rating: 16V; RoHS Compliant: Yes; Voltage Rating (DC): 16V; Case/Package: 0805; Number of Pins: 2; Thickness: 0.053inch; Voltage: 16V; Mount: Surface Mount; Packaging: Tape and Reel; Lead Free: Lead Free; Case Code (Imperial): 0805; Series: GRM; Width: 0.049inch; Package Quantity: 1; Construction: Flat; Min Operating Temperature: -55°C; Termination: SMD/SMT; Max Operating Temperature: 125°C; Length: 2mm; Dielectric: X7R; Depth: 1.25mm; REACH SVHC: No SVHC; Height: 1.25mm; Capacitance: 4.7uF
C57 = CMP-2006-02460-1: as C2 on sheet Serializer_DS90UB913A
LED1 = LTST-C191KRKT: LED; Manufacturer_Name: Lite-On; Datasheet Link: http://www.mouser.com/ds/2/239/S_110_LTST-C191KRKT-539838.pdf; Height: 0.55mm; Manufacturer_Part_Number: LTST-C191KRKT; Mouser Part Number: 859-LTST-C191KRKT; Mouser Price/Stock: https://www.mouser.co.uk/ProductDetail/LITEON/LTST-C191KRKT?qs=BAIUz4Y8PJBLfOhzue0q%252BA%3D%3D; Arrow Part Number: LTST-C191KRKT; Arrow Price/Stock: https://www.arrow.com/en/products/ltst-c191krkt/lite-on-technology?utm_currency=USD&region=nac
R41 R42 = CMP-2000-00279-1: Manufacturer: Panasonic; Part Number: ERJ-3EKF1652V
R43-R46 R51 R52 R54 R55 = CMP-1012-00623-3: as R33 on sheet BuckRegulatorOnSer; Number of Pins: 2; Package Reference: 603; Depth: 0.8mm; Mount: SurfaceMount; Package Description: 2-Pin Surface Mount Device, Body 1.6 x 0.85 mm; Datasheet Version: 02/2017; Length: 1.6mm; Lead Free: LeadFree; Height: 0.45mm; Number of Terminations: 2; Max Power Dissipation: 100mW; Min Operating Temperature: -55degC; Datasheet URL: https://industrial.panasonic.com/cdbs/www-data/pdf/RDA0000/AOA0000C304.pdf; Termination: SMD/SMT; Case Code (Metric): 1608; Case Code (Imperial): 0603; Tolerance: 1%; Max Operating Temperature: 155degC; RoHSCompliant: true; Voltage Rating (DC): 75V; Radiation Hardening: No; Packaging: TapeandReel; Composition: ThickFilm; Mounting Technology: SurfaceMount; Manufacturer URL: http://www.panasonic.com/; Width: 0.031inch; REACH SVHC: NoSVHC; Contact Plating: Tin; Military Standard: Not; Package Quantity: 1
R47 R48 R56 R57 = CMP-2000-00700-2: as R32 on sheet BuckRegulatorOnSer; Mouser Description: Resistor, Chip Thick Film, 0 Ohm, 0.1w, Resistor, Chip Thick Film, 0 Ohm, 0.1w, 5%; Ipc Land Pattern Name: RESC16080X45; Category: Res; Package: 0603; Temperature: -55°C to +155°C; Temperature Range Low: -55°C; Series: ERJ; Resistance: 0Ω; RoHS: TRUE; Composition: Thick Film; Octopart: https://octopart.com/erj-3gey0r00v-panasonic-55389238; Device Class L1: Passive Components; Footprint Url: https://industrial.panasonic.com/cdbs/www-data/pdf/RDA0000/DMA0000COL17.pdf; ComponentLink2Description: Datasheet; Device Class L2: Resistors; Temperature Range High: +155°C; Digikey Description: RES SMD 0 OHM JUMPER 1/10W 0603; Lead Free: Yes; Device Class L3: Chip SMD Resistors; Height: 0.55mm; ComponentLink2URL: https://industrial.panasonic.com/cdbs/www-data/pdf/RDA0000/AOA0000C301.pdf; Automotive: Yes
R49 R50 = CMP-2000-00512-1: Part Number: ERJ-3EKF4531V; Manufacturer: Panasonic
R53 = CMP-2002-01143-1: Manufacturer: Panasonic; Part Number: ERJ2RKF3300X
R58 = CMP-2002-00433-1: as R1 on sheet Serializer_DS90UB913A
R59 = CMP-2000-07451-1: as R15 on sheet Serializer_DS90UB913A; Number of Terminations: 2; Mount: SurfaceMount; Height: 0.35mm; Packaging: TapeandReel; Contact Plating: Tin; Manufacturer URL: http://www.panasonic.com/; Composition: ThickFilm; Max Operating Temperature: 155degC; REACH SVHC: NoSVHC; Case/Package: 0402; Package Reference: 402; Depth: 0.5mm; Package Description: 2-Pin Surface Mount Device, Body 1 x 0.5 mm; Datasheet URL: https://industrial.panasonic.com/cdbs/www-data/pdf/RDA0000/AOA0000C301.pdf; RoHSCompliant: True; Case Code (Imperial): 0402; Military Standard: Not; Min Operating Temperature: -55degC; Power Rating: 100mW; Datasheet Version: 03/2015; Length: 1mm; Case Code (Metric): 1005; Termination: SMD/SMT; Mounting Technology: SurfaceMount; Voltage Rating: 50V; Width: 0.02inch; Package Quantity: 1; Lead Free: LeadFree; Radiation Hardening: No
U2-U5 = CMP-0062-01809-4: 500mA Low Dropout CMOS Linear Regulators with Adjustable Output Stable with Ceramic Output Capacitors, 5-pin SOT-223, Pb-Free, 1000 Reel; Manufacturer: Texas Instruments; PackageTopMarking: XYTT*LJUB; CompType: LDO IC; PowerWise: Y; PackageReference: NDC0005A; ComponentLink1Description: Datasheet URL; RoHS: Y; PackageDescription: Moldec SOT-223, 6.50 x 3.56 x 1.6mm Body, 5 Lead, 1.5mm Pitch; ComponentLink1URL: http://www.ti.com/general/docs/lit/getliterature.tsp?genericPartNumber=LP38693-ADJ&fileType=pdf; PartNumber: LP38693MP-ADJ/NOPB; High-Reliability: Y; Code_JEDEC: TO-261-AB; Code_IPC: SOT223-5; PinCount: 5
Y1 = ECS-3963-480-BN-TR: miniature SMD crystal controlled oscillators; Package: None; Price: None; Value: *; MP: ECS-3963-480-BN-TR; Availability: Unavailable

## Sheet FTDI_USB_To_UART.SchDoc
size A3; SheetNumber: 5; SheetTotal: 6
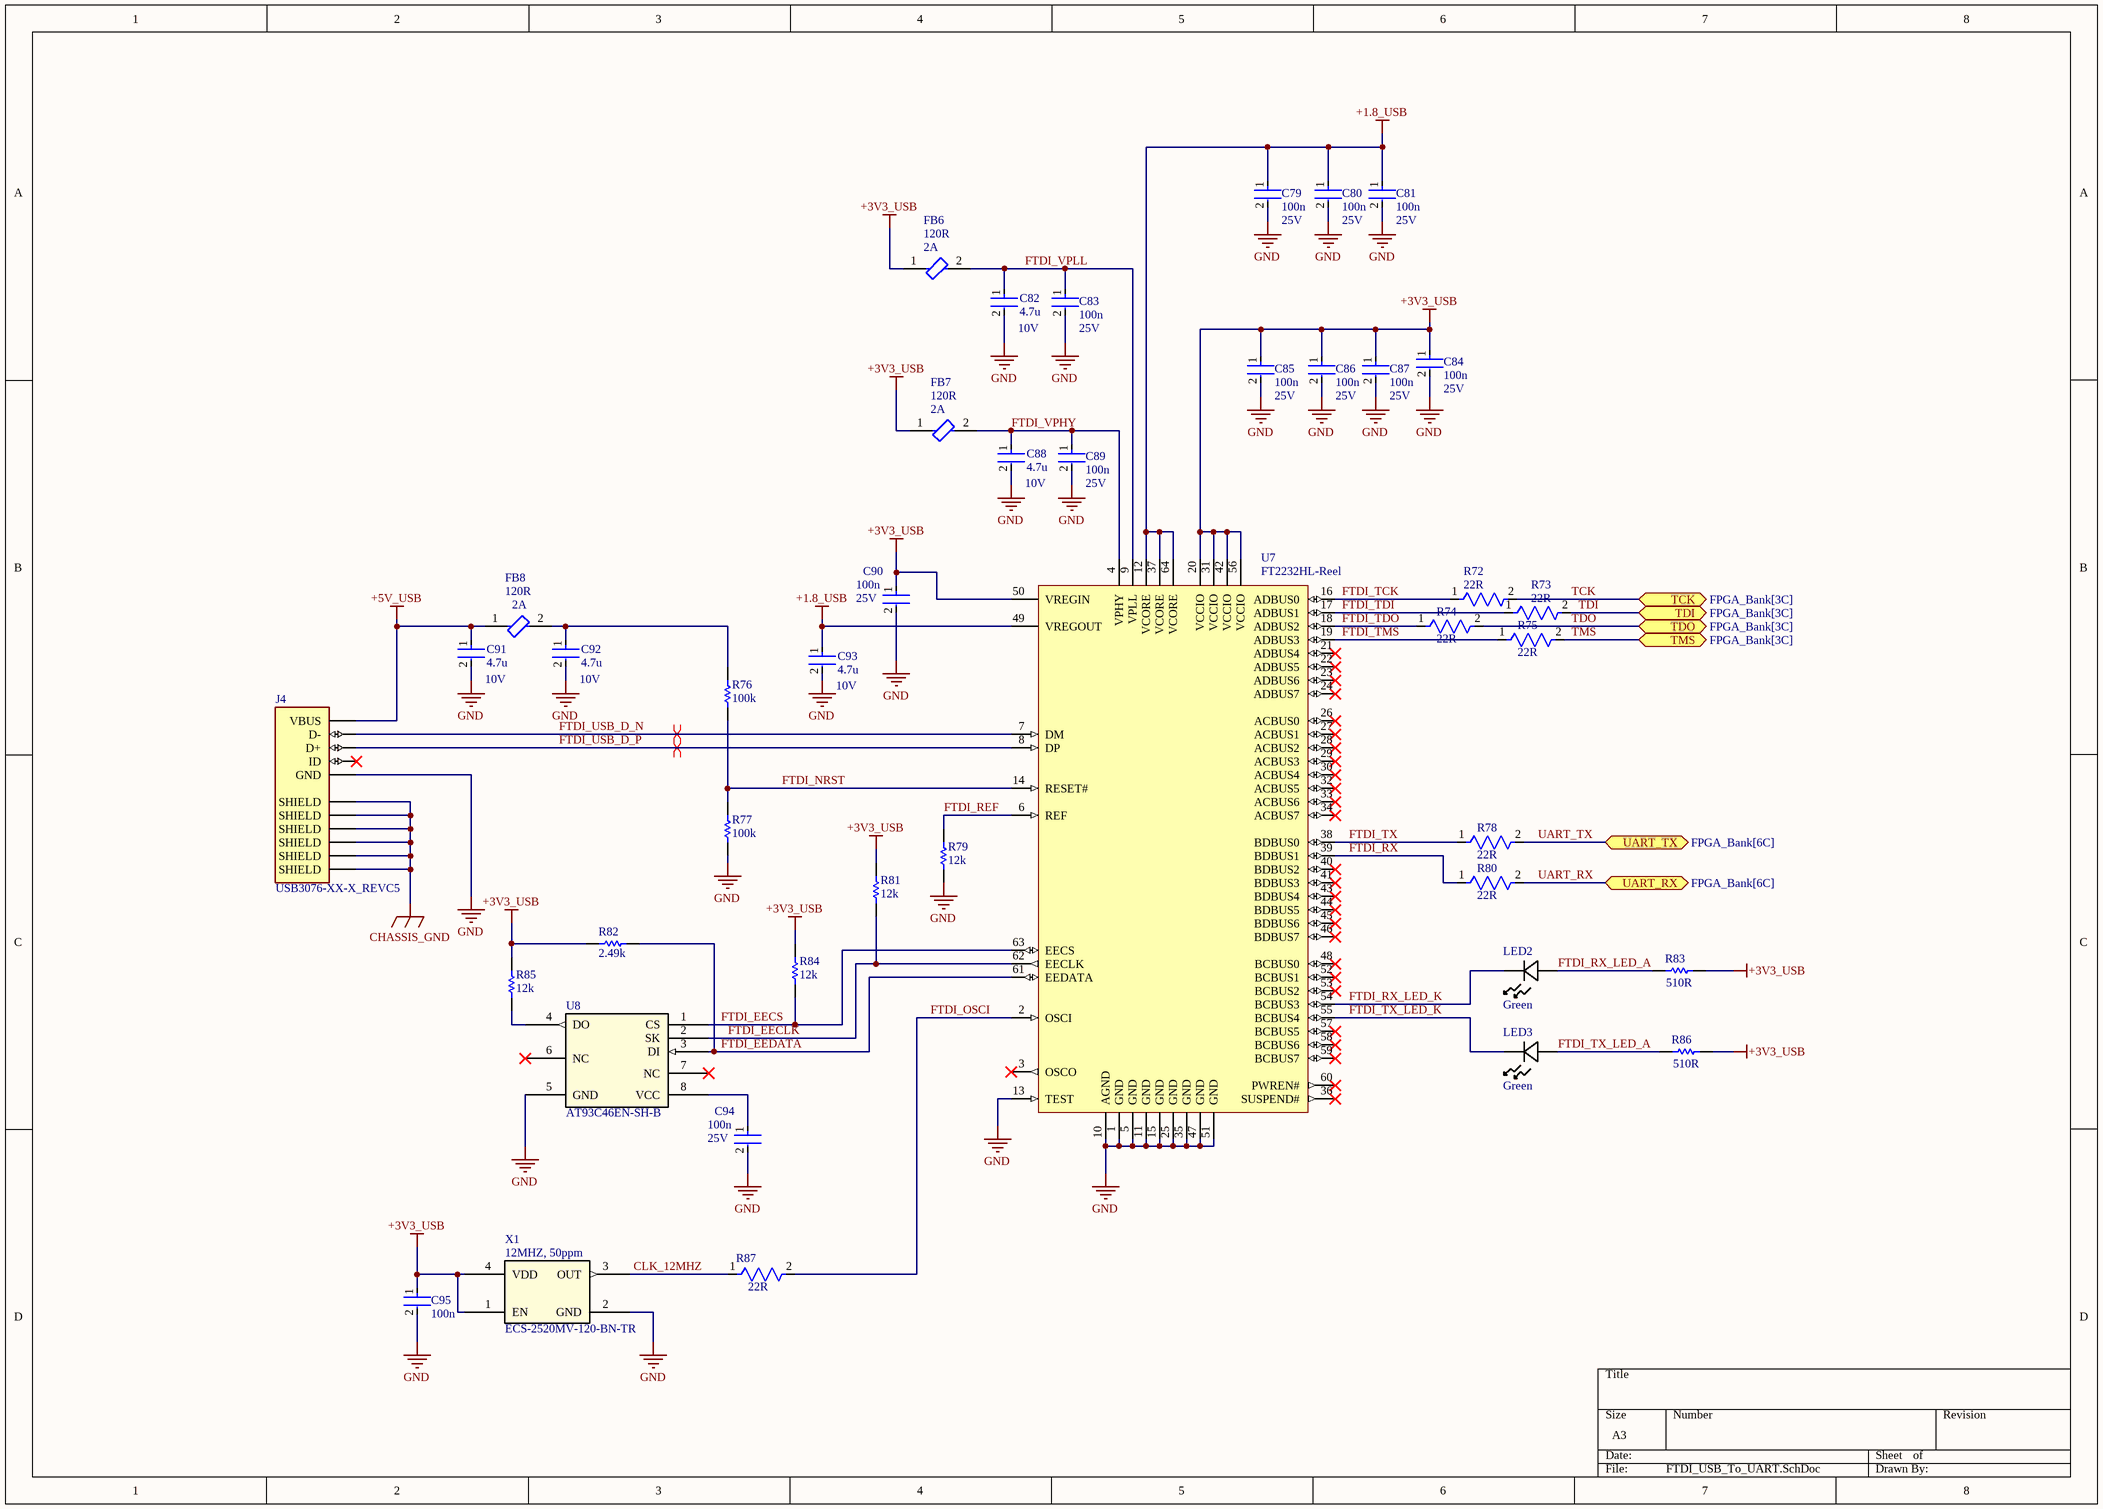
[diagram p3: FTDI_USB_To_UART.SchDoc]

### Parts
C79  100n  [FP-CL278-IPC_C]
C80  100n  [FP-CL278-IPC_C]
C81  100n  [FP-CL278-IPC_C]
C82  4.7u  [FP-CL282-IPC_C]
C83  100n  [FP-CL278-IPC_C]
C84  100n  [FP-CL278-IPC_C]
C85  100n  [FP-CL278-IPC_C]
C86  100n  [FP-CL278-IPC_C]
C87  100n  [FP-CL278-IPC_C]
C88  4.7u  [FP-CL282-IPC_C]
C89  100n  [FP-CL278-IPC_C]
C90  100n  [FP-CL278-IPC_C]
C91  4.7u  [FP-CL282-IPC_C]
C92  4.7u  [FP-CL282-IPC_C]
C93  4.7u  [FP-CL282-IPC_C]
C94  100n  [FP-CL278-IPC_C]
C95  100n  [FP-CL278-IPC_C]
FB6  120R  [FP-BLM15-0_05-d0_7-MFG]
FB7  120R  [FP-BLM15-0_05-d0_7-MFG]
FB8  120R  [FP-BLM15-0_05-d0_7-MFG]
J4  USB3076-XX-X_REVC5  [GCT_USB3076-XX-X_REVC5]
LED2  Green  [LED_LTW-C193TS5_LTO]
LED3  Green  [LED_LTW-C193TS5_LTO]
R72  22R  [FP-RC0402-0_4-MFG]
R73  22R  [FP-RC0402-0_4-MFG]
R74  22R  [FP-RC0402-0_4-MFG]
R75  22R  [FP-RC0402-0_4-MFG]
R76  100k  [RESC1005X40X25NL05T10]
R77  100k  [RESC1005X40X25NL05T10]
R78  22R  [FP-RC0402-0_4-MFG]
R79  12k  [RESC1005X40X25NL05T10]
R80  22R  [FP-RC0402-0_4-MFG]
R81  12k  [RESC1005X40X25NL05T10]
R82  2.49k  [RESC1005X40X25NL05T10]
R83  510R  [RESC1005X40X25LL05T05]
R84  12k  [RESC1005X40X25NL05T10]
R85  12k  [RESC1005X40X25NL05T10]
R86  510R  [RESC1005X40X25LL05T05]
R87  22R  [FP-RC0402-0_4-MFG]
U7  FT2232HL-Reel  [LQFP-64_M]
U8  AT93C46EN-SH-B  [8S1_ATM]
X1  ECS-2520MV-120-BN-TR  [SMD4_ECS-2520MV_ECS]

### Ports
TCK (bidir, see FPGA_Bank[3C]), TDI (bidir, see FPGA_Bank[3C]), TDO (bidir, see FPGA_Bank[3C]), TMS (bidir, see FPGA_Bank[3C]), UART_RX (bidir, see FPGA_Bank[6C]), UART_TX (bidir, see FPGA_Bank[6C])

### Nets
+1.8_USB: C79.1 C80.1 C81.1 C93.1 U7.12(VCORE) U7.37(VCORE) U7.49(VREGOUT) U7.64(VCORE)
+3V3_USB: C84.1 C85.1 C86.1 C87.1 C90.1 C95.1 FB6.1 FB7.1 R81.2 R82.1 R83.2 R84.2 R85.2 R86.2 U7.20(VCCIO) U7.31(VCCIO) U7.42(VCCIO) U7.50(VREGIN) U7.56(VCCIO) X1.1(EN) X1.4(VDD)
+5V_USB: C91.1 FB8.1 J4.1(VBUS)
CHASSIS_GND: J4.6(SHIELD) J4.7(SHIELD) J4.8(SHIELD) J4.9(SHIELD) J4.10(SHIELD) J4.11(SHIELD)
GND: C79.2 C80.2 C81.2 C82.2 C83.2 C84.2 C85.2 C86.2 C87.2 C88.2 C89.2 C90.2 C91.2 C92.2 C93.2 C94.2 C95.2 J4.5(GND) R77.1 R79.1 U7.1(GND) U7.5(GND) U7.10(AGND) U7.11(GND) U7.13(TEST) U7.15(GND) U7.25(GND) U7.35(GND) U7.47(GND) U7.51(GND) U8.5(GND) X1.2(GND)
CLK_12MHZ: R87.1 X1.3(OUT)  [project net CLK_12MHZ_5]
FTDI_EECLK: R81.1 U7.62(EECLK) U8.2(SK)  [project net FTDI_EECLK_5]
FTDI_EECS: R84.1 U7.63(EECS) U8.1(CS)  [project net FTDI_EECS_5]
FTDI_EEDATA: R82.2 U7.61(EEDATA) U8.3(DI)  [project net FTDI_EEDATA_5]
FTDI_NRST: R76.1 R77.2 U7.14(RESET#)  [project net FTDI_NRST_5]
FTDI_OSCI: R87.2 U7.2(OSCI)  [project net FTDI_OSCI_5]
FTDI_REF: R79.2 U7.6(REF)  [project net FTDI_REF_5]
FTDI_RX: R80.1 U7.39(BDBUS1)  [project net FTDI_RX_5]
FTDI_RX_LED_A: LED2.2 R83.1  [project net FTDI_RX_LED_A_5]
FTDI_RX_LED_K: LED2.1 U7.54(BCBUS3)  [project net FTDI_RX_LED_K_5]
FTDI_TCK: R72.1 U7.16(ADBUS0)  [project net FTDI_TCK_5]
FTDI_TDI: R73.1 U7.17(ADBUS1)  [project net FTDI_TDI_5]
FTDI_TDO: R74.1 U7.18(ADBUS2)  [project net FTDI_TDO_5]
FTDI_TMS: R75.1 U7.19(ADBUS3)  [project net FTDI_TMS_5]
FTDI_TX: R78.1 U7.38(BDBUS0)  [project net FTDI_TX_5]
FTDI_TX_LED_A: LED3.2 R86.1  [project net FTDI_TX_LED_A_5]
FTDI_TX_LED_K: LED3.1 U7.55(BCBUS4)  [project net FTDI_TX_LED_K_5]
FTDI_USB_D_N: J4.2(D-) U7.7(DM)  [project net FTDI_USB_D_N_5]
FTDI_USB_D_P: J4.3(D+) U7.8(DP)  [project net FTDI_USB_D_P_5]
FTDI_VPHY: C88.1 C89.1 FB7.2 U7.4(VPHY)  [project net FTDI_VPHY_5]
FTDI_VPLL: C82.1 C83.1 FB6.2 U7.9(VPLL)  [project net FTDI_VPLL_5]
TCK: R72.2 ; port TCK
TDI: R73.2 ; port TDI
TDO: R74.2 ; port TDO
TMS: R75.2 ; port TMS
UART_RX: R80.2 ; port UART_RX
UART_TX: R78.2 ; port UART_TX
NetC92_1: C92.1 FB8.2 R76.2
NetC94_1: C94.1 U8.8(VCC)
NetR85_1: R85.1 U8.4(DO)

Not connected (* = marked no-connect by the designer): J4 4(ID)*; U7 3(OSCO)* 21(ADBUS4)* 22(ADBUS5)* 23(ADBUS6)* 24(ADBUS7)* 26(ACBUS0)* 27(ACBUS1)* 28(ACBUS2)* 29(ACBUS3)* 30(ACBUS4)* 32(ACBUS5)* 33(ACBUS6)* 34(ACBUS7)* 36(SUSPEND#)* 40(BDBUS2)* 41(BDBUS3)* 43(BDBUS4)* 44(BDBUS5)* 45(BDBUS6)* 46(BDBUS7)* 48(BCBUS0)* 52(BCBUS1)* 53(BCBUS2)* 57(BCBUS5)* 58(BCBUS6)* 59(BCBUS7)* 60(PWREN#)*; U8 6(NC)* 7(NC)*

### Layout directives
differential pair: FTDI_USB_D_N_5, FTDI_USB_D_P_5

### Notes on the sheet
- 25V
- (near C81) 25V
- (near FB6) 2A
- 10V
- (near C83) 25V
- (near FB7) 2A
- (near C84) 25V
- (near C89) 25V
- (near FB8) 2A
- (near C90) 25V
- (near C91) 10V
- (near C92) 10V
- (near C93) 10V
- (near C94) 25V
- (near X1) 12MHZ, 50ppm

### Library data of the parts
C79-C81 C83-C87 C89 C90 C94 C95 = CMP-13271-000728-1: Cap Ceramic 100nF 25V X5R ±10% SMD 0402 +85°C Paper T/R; Package Quantity: 1; Height: 0.5mm; Case Code (Metric): 1005; Thickness: 0.022inch; Mount: Surface Mount; Lead Free: Lead Free; Case Code (Imperial): 0402; Packaging: Tape and Reel; Depth: 0.5mm; Voltage: 25V; Min Operating Temperature: -55°C; Voltage Rating: 25V; Dielectric: X5R; Case/Package: 0402; Tolerance: 10%; Width: 0.02inch; Max Operating Temperature: 85°C; Capacitance: 100nF; Length: 1mm; Radiation Hardening: No; Voltage Rating (DC): 25V
C82 C88 C91-C93 = CMP-13271-000548-1: Cap Ceramic 4.7uF 10V X5R ±20% SMD 0402 +85°C Paper T/R; Capacitance: 4.7uF; Max Operating Temperature: 85°C; Lead Free: Lead Free; Tolerance: 20%; Voltage Rating: 10V; Dielectric: X5R; Width: 0.02inch; Length: 0.039inch; Case/Package: 0402; Min Operating Temperature: -55°C; Packaging: Tape and Reel; Thickness: 0.022inch; Case Code (Imperial): 0402; Package Quantity: 10000; Case Code (Metric): 1005; Mount: Surface Mount
FB6-FB8 = CMP-0686-00133-3: Chip Ferrite Bead, 0402, 120Ω @ 100MHz, 0.055Ω, 25%, 2A; DC Resistance (DCR): 55mR; Number of Circuits: 1; Material: Steel; Lead Free: Lead Free; Package Quantity: 10000; Impedance: 120R; Width: 0.5mm; Case Code (Metric): 1005; Test Frequency: 100MHz; Weight: 2.3E-05oz; Max DC Current: 2A; Current Rating: 2A; REACH SVHC: No SVHC; Case Code (Imperial): 0402; Min Operating Temperature: -55°C; Max Operating Temperature: 125°C; Max Current Rating: 2A; Series: EMIFIL®, BLM15P; Tolerance: 25%; Termination: SMD/SMT; Number of Lines: 1; Case/Package: 0402; RoHS Compliant: Yes; Number of Pins: 2; Length: 1mm; Height: 0.5mm; Packaging: Tape and Reel
J4 = USB3076-XX-X_REVC5: USB - micro B USB 2.0 Receptacle Connector 5 Position Surface Mount, Right Angle; Through Hole, 2.35mm profile, 5 Pins, Horizontal, Bottom mount; MP: USB3076-30-A; MF: Global Connector Technology; SnapEDA_Link: https://www.snapeda.com/parts/USB3076-30-A/Global+Connector+Technology/view-part/?ref=snap; Package: None; Check_prices: https://www.snapeda.com/parts/USB3076-30-A/Global+Connector+Technology/view-part/?ref=eda; Purchase-URL: https://pricing.snapeda.com/search/part/USB3076-30-A/?ref=eda; Price: None; Value: *; Availability: In Stock
LED2 LED3 = LTST-C191TGKT: No Description Available; Manufacturer_Name: LITE-ON; Copyright: Copyright (C) 2025 Ultra Librarian. All rights reserved.; Manufacturer_Part_Number: LTST-C191TGKT
R72-R75 R78 R80 R87 = CMP-2002-07520-2: Tolerance: 1%; Power Rating: 63mW; Voltage Rating: 50V; Temperature Coefficient: 100ppm/°C; Resistance: 22Ω; Termination: SMD/SMT; Depth: 500µm; Packaging: Tape & Reel; Height: 400µm; Width: 500µm; Case Code (Imperial): 0402; Length: 1mm; Schedule B: 8533210045, 8533210045; Case/Package: 0402; Max Operating Temperature: 155°C; Min Operating Temperature: -55°C; REACH SVHC: Unknown; RoHS: Compliant; Military Standard: Not; Voltage Rating (DC): 50V; Lead Free: Lead Free; Voltage Rating (AC): 50V; Number of Pins: 2; Composition: Thick Film
R76 R77 R79 R81 R84 R85 = CMP-2002-07343-1: Part Number: RC0402FR-07100KL; Manufacturer: Yageo / Phycomp
R82 = CMP-2002-07571-1: Part Number: RC0402FR-072K49L; Manufacturer: Yageo
R83 R86 = CMP-2002-00074-1: Part Number: CRCW0402510RFKED; Manufacturer: Vishay Dale
U7 = CMP-0078-00023-3: Dual High Speed USB To Multipurpose UART/FIFO IC, 64-pin LQFP, Tape and Reel; Manufacturer: FTDI; DatasheetVersion: ver 2.21, Jun-2012; ComponentLink1URL: http://www.ftdichip.com/; PartNumber: FT2232HL-Reel; ComponentLink2Description: Datasheet; RevisionNote: DatasheetVersion updated to 2.21 Jun-2012; PackageVersion: Jun-12; ComponentLink1Description: Manufacturer URL; ComponentLink2URL: http://www.ftdichip.com/Support/Documents/DataSheets/ICs/DS_FT2232H.pdf; PackageReference: LQFP-64; PackageDescription: 64-Pin Thin Quad Flat Pack, 10 x 10 x 1.4 mm Body, 0.5 mm Pitch
U8 = AT93C46EN-SH-B: No Description Available; Manufacturer_Name: Microchip; Copyright: Copyright (C) 2025 Ultra Librarian. All rights reserved.; Manufacturer_Part_Number: AT93C46EN-SH-B; RefDes: RefDes; Type: Type
X1 = ECS-2520MV-120-BN-TR: Description; Manufacturer_Name: ECS International; Copyright: Copyright (C) 2025 Ultra Librarian. All rights reserved.; Manufacturer_Part_Number: ECS-2520MV-120-BN-TR; RefDes: RefDes; Type: Type